# Altium schematic sheet Buffer.SchDoc
size A4
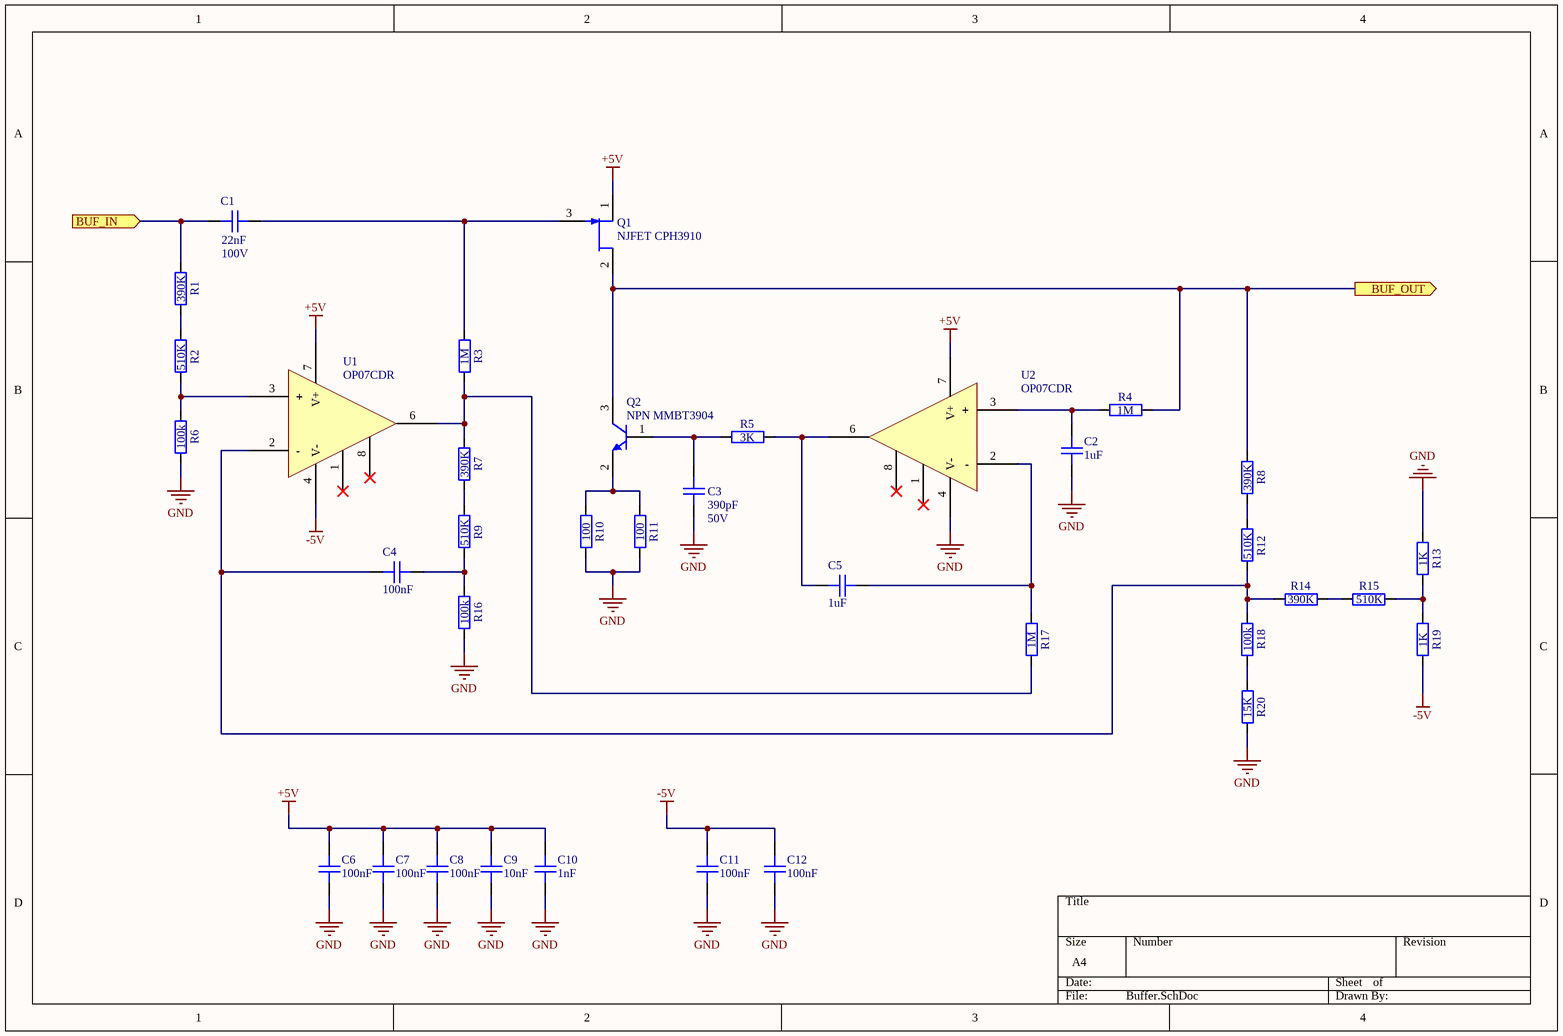
[diagram p0: Buffer.SchDoc]

## Parts
C1  value 22nF  Voltage Rating: 100V  [GEN_C_0603]  (hidden comment: CAP 22nF 100V X7R 0603)
C2  value 1uF  [GEN_C_0402]  (hidden comment: CAP 1uF 25V X5R 0402)
C3  value 390pF  Voltage Rating: 50V  [GEN_C_0402]  (hidden comment: CAP 390pF 50V C0G 0402)
C4  value 100nF  [GEN_C_0402]  (hidden comment: CAP 100nF 16V X7R 0402)
C5  value 1uF  [GEN_C_0402]  (hidden comment: CAP 1uF 25V X5R 0402)
C6  value 100nF  [GEN_C_0402]  (hidden comment: CAP 100nF 16V X7R 0402)
C7  value 100nF  [GEN_C_0402]  (hidden comment: CAP 100nF 16V X7R 0402)
C8  value 100nF  [GEN_C_0402]  (hidden comment: CAP 100nF 16V X7R 0402)
C9  value 10nF  [GEN_C_0402]  (hidden comment: CAP 10nF 50V X7R 0402)
C10  value 1nF  [GEN_C_0402]  (hidden comment: CAP 1nF 50V X7R 0402)
C11  value 100nF  [GEN_C_0402]  (hidden comment: CAP 100nF 16V X7R 0402)
C12  value 100nF  [GEN_C_0402]  (hidden comment: CAP 100nF 16V X7R 0402)
Q1  NJFET CPH3910  [ON_SOT23_CPH3]
Q2  NPN MMBT3904  [MMC_SOT23]
R1  value 390K  [GEN_R_0402]  (hidden comment: RES 390K OHM 1% 1/10W 0402)
R2  value 510K  [GEN_R_0402]  (hidden comment: RES 510K OHM 1% 1/10W 0402)
R3  value 1M  [GEN_R_0402]  (hidden comment: RES 1M OHM 1% 1/10W 0402)
R4  value 1M  [GEN_R_0402]  (hidden comment: RES 1M OHM 1% 1/10W 0402)
R5  value 3K  [GEN_R_0402]  (hidden comment: RES 3K OHM 1% 1/10W 0402)
R6  value 100k  [GEN_R_0402]  (hidden comment: RES 100K OHM 1% 1/10W 0402)
R7  value 390K  [GEN_R_0402]  (hidden comment: RES 390K OHM 1% 1/10W 0402)
R8  value 390K  [GEN_R_0402]  (hidden comment: RES 390K OHM 1% 1/10W 0402)
R9  value 510K  [GEN_R_0402]  (hidden comment: RES 510K OHM 1% 1/10W 0402)
R10  value 100  [GEN_R_0402]  (hidden comment: RES 100 OHM 1% 1/10W 0402)
R11  value 100  [GEN_R_0402]  (hidden comment: RES 100 OHM 1% 1/10W 0402)
R12  value 510K  [GEN_R_0402]  (hidden comment: RES 510K OHM 1% 1/10W 0402)
R13  value 1K  [GEN_R_0402]  (hidden comment: RES 1K OHM 1% 1/10W 0402)
R14  value 390K  [GEN_R_0402]  (hidden comment: RES 390K OHM 1% 1/10W 0402)
R15  value 510K  [GEN_R_0402]  (hidden comment: RES 510K OHM 1% 1/10W 0402)
R16  value 100k  [GEN_R_0402]  (hidden comment: RES 100K OHM 1% 1/10W 0402)
R17  value 1M  [GEN_R_0402]  (hidden comment: RES 1M OHM 1% 1/10W 0402)
R18  value 100k  [GEN_R_0402]  (hidden comment: RES 100K OHM 1% 1/10W 0402)
R19  value 1K  [GEN_R_0402]  (hidden comment: RES 1K OHM 1% 1/10W 0402)
R20  value 15K  [GEN_R_0402]  (hidden comment: RES 15K OHM 1% 1/10W 0402)
U1  OP07CDR  [TI_SOIC8_D0008A]
U2  OP07CDR  [TI_SOIC8_D0008A]

## Ports
BUF_IN (in), BUF_OUT (out)

## Nets
+5V: C6.1 C7.1 C8.1 C9.2 C10.2 Q1.1(S) U1.7(V+) U2.7(V+)
-5V: C11.1 C12.1 R19.2 U1.4(V-)
GND: C2.1 C3.1 C6.2 C7.2 C8.2 C9.1 C10.1 C11.2 C12.2 R6.2 R10.1 R11.1 R13.1 R16.2 R20.1 U2.4(V-)
BUF_IN: C1.2 R1.1 ; port BUF_IN
BUF_OUT: Q1.2(D) Q2.3(C) R4.1 R8.1 ; port BUF_OUT
NetC1_1: C1.1 Q1.3(G) R3.2
NetC2_2: C2.2 R4.2 U2.3(+)
NetC3_2: C3.2 Q2.1(B) R5.2
NetC4_1: C4.1 R9.2 R16.1
NetC4_2: C4.2 R12.2 R14.1 R18.1 U1.2(-)
NetC5_1: C5.1 R17.2 U2.2(-)
NetC5_2: C5.2 R5.1 U2.6(OUT)
NetQ2_2: Q2.2(E) R10.2 R11.2
NetR1_2: R1.2 R2.1
NetR2_2: R2.2 R6.1 U1.3(+)
NetR3_1: R3.1 R7.1 R17.1 U1.6(OUT)
NetR7_2: R7.2 R9.1
NetR8_2: R8.2 R12.1
NetR13_2: R13.2 R15.2 R19.1
NetR14_2: R14.2 R15.1
NetR18_2: R18.2 R20.2

Not connected (* = marked no-connect by the designer): U1 1(N1)* 8(N2)*; U2 1(N1)* 8(N2)*

## Library data of the parts
R1 R7 R8 R14 = RES 390K OHM 1% 1/10W 0402: Power Rating: 0.1W; Tolerance: 1%; Package: 0402; Supplier 1: Digi-Key; Supplier Part Number 1: P390KLCT-ND
R2 R9 R12 R15 = RES 510K OHM 1% 1/10W 0402: Power Rating: 0.1W; Tolerance: 1%; Package: 0402; Supplier 1: Digi-Key; Supplier Part Number 1: P510KLCT-ND
R3 R4 R17 = RES 1M OHM 1% 1/10W 0402: Power Rating: 0.1W; Tolerance: 1%; Package: 0402; Supplier 1: Digi-Key; Supplier Part Number 1: P1.00MLCT-ND
R5 = RES 3K OHM 1% 1/10W 0402: Power Rating: 0.1W; Tolerance: 1%; Package: 0402; Supplier 1: Digi-Key; Supplier Part Number 1: P3.00KLCT-ND
R6 R16 R18 = RES 100K OHM 1% 1/10W 0402: Power Rating: 0.1W; Tolerance: 1%; Package: 0402; Supplier 1: Digi-Key; Supplier Part Number 1: P100KLCT-ND
R10 R11 = RES 100 OHM 1% 1/10W 0402: Power Rating: 0.1W; Tolerance: 1%; Package: 0402; Supplier 1: Digi-Key; Supplier Part Number 1: P100LCT-ND
R13 R19 = RES 1K OHM 1% 1/10W 0402: Power Rating: 0.1W; Tolerance: 1%; Package: 0402; Supplier 1: Digi-Key; Supplier Part Number 1: P1.00KLCT-ND
R20 = RES 15K OHM 1% 1/10W 0402: Power Rating: 0.1W; Tolerance: 1%; Package: 0402; Supplier 1: Digi-Key; Supplier Part Number 1: P15.0KLCT-ND
U1 U2 = IC OPAMP OP07CDR: Supplier 1: Digi-Key; Supplier Part Number 1: 296-14626-1-ND
C1 = CAP 22nF 100V X7R 0603: Package: 0603; Supplier 1: Digi-Key; Supplier Part Number 1: 490-4782-1-ND
C2 C5 = CAP 1uF 25V X5R 0402: Package: 0402; Voltage Rating: 25V; Supplier 1: Digi-Key; Supplier Part Number 1: 490-10017-1-ND
C3 = CAP 390pF 50V C0G 0402: Package: 0402; Supplier 1: Digi-Key; Supplier Part Number 1: 490-8202-1-ND
C4 C6-C8 C11 C12 = CAP 100nF 16V X7R 0402: Package: 0402; Voltage Rating: 16V; Supplier 1: Digi-Key; Supplier Part Number 1: 490-4759-1-ND
C9 = CAP 10nF 50V X7R 0402: Package: 0402; Voltage Rating: 50V; Supplier 1: Digi-Key; Supplier Part Number 1: 490-4762-1-ND
C10 = CAP 1nF 50V X7R 0402: Package: 0402; Voltage Rating: 50V; Supplier 1: Digi-Key; Supplier Part Number 1: 490-4761-1-ND
Q1 = NJFET CPH3910: Supplier 1: Digi-Key; Supplier Part Number 1: CPH3910-TL-EOSCT-ND
Q2 = NPN MMBT3904: Supplier 1: Digi-Key; Supplier Part Number 1: MMBT3904TPMSCT-ND